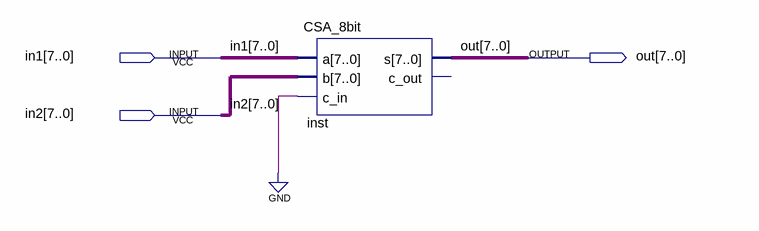
[diagram p0: schematic sheet]
// Quartus schematic Add_8bit.bdf as structural Verilog: 1 symbols, 3 pins
module Add_8bit (
  input  [7:0] in1,
  input  [7:0] in2,
  output [7:0] out
);

  CSA_8bit inst (.a(in1), .b(in2), .c_in(1'b0), .s(out));  // open: c_out
endmodule
